# Altium schematic sheet Voltage Monitor.SchDoc
size A4
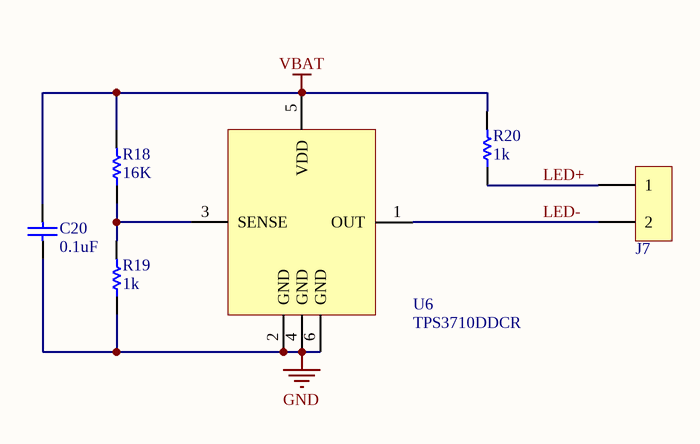
[diagram p0: Voltage Monitor.SchDoc]

## Parts
C20  0.1uF  [CAPC1608X09N]
J7  2POS THRU HOLE 2.54MM  [2POS Through Hole 2.54MM]  (value not drawn)
R18  16K  [RESC1608X06N]
R19  1k  [RESC1608X06N]
R20  1k  [RESC1608X06N]
U6  TPS3710DDCR  [SOT95P280X110-6N (DDC)]

## Nets
GND: C20.1 R19.1 U6.2(GND) U6.4(GND) U6.6(GND)
VBAT: C20.2 R18.2 R20.2 U6.5(VDD)
LED+: J7.1 R20.1
LED-: J7.2 U6.1(OUT)
NetR18_1: R18.1 R19.2 U6.3(SENSE)

## Library data of the parts
C20 = CAP CER 0.1uF 0603: Voltage: 50V; Rating: X7R; Tolerance: 10%; Value: 0.1uF; Digikey Part Number: 490-1519-1-ND; Package: 0603
R18 = RES 16K 0603: Manufacturer: Yageo; Tolerance: 1%; Type: RES; Footprint: 0603; Value: 16K; Digikey Part Number: 311-16KGRCT-ND
R19 R20 = RES 1K 0603: Manufacturer: Panasonic; Manufacturer Part Number: ERJ-PA3F1001V; Tolerance: 1%; Power: 0.25W; Type: RES; Footprint: 0603; Temperature: 155dC; Digikey Part Number: P1.0KBYCT-ND; Value: 1k
U6 = TPS3710DDCR: Voltage Monitor, 400mV, Open Drain; Manufacturer: Texas Instruments; Value: TPS3710DDCR; Digikey Part Number: 296-43105-1-ND